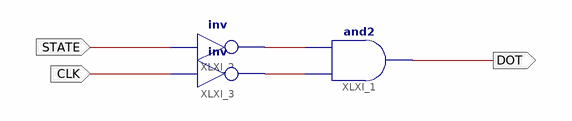
[diagram p0: schematic sheet 1]
// Xilinx ISE schematic DOT_DISPLAY.sch (spartan6) as structural Verilog: 3 symbols, 3 ports
module DOT_DISPLAY (
  input  STATE,
  input  CLK,
  output DOT
);

  wire XLXN_1, XLXN_2;

  and XLXI_1 (DOT, XLXN_2, XLXN_1);
  not XLXI_2 (XLXN_1, STATE);
  not XLXI_3 (XLXN_2, CLK);
endmodule
